# Altium schematic sheet Elkapod_power_supply.SchDoc: Elkapod Power Supply Block Diagram
size A3; SheetNumber: 1; SheetTotal: 10
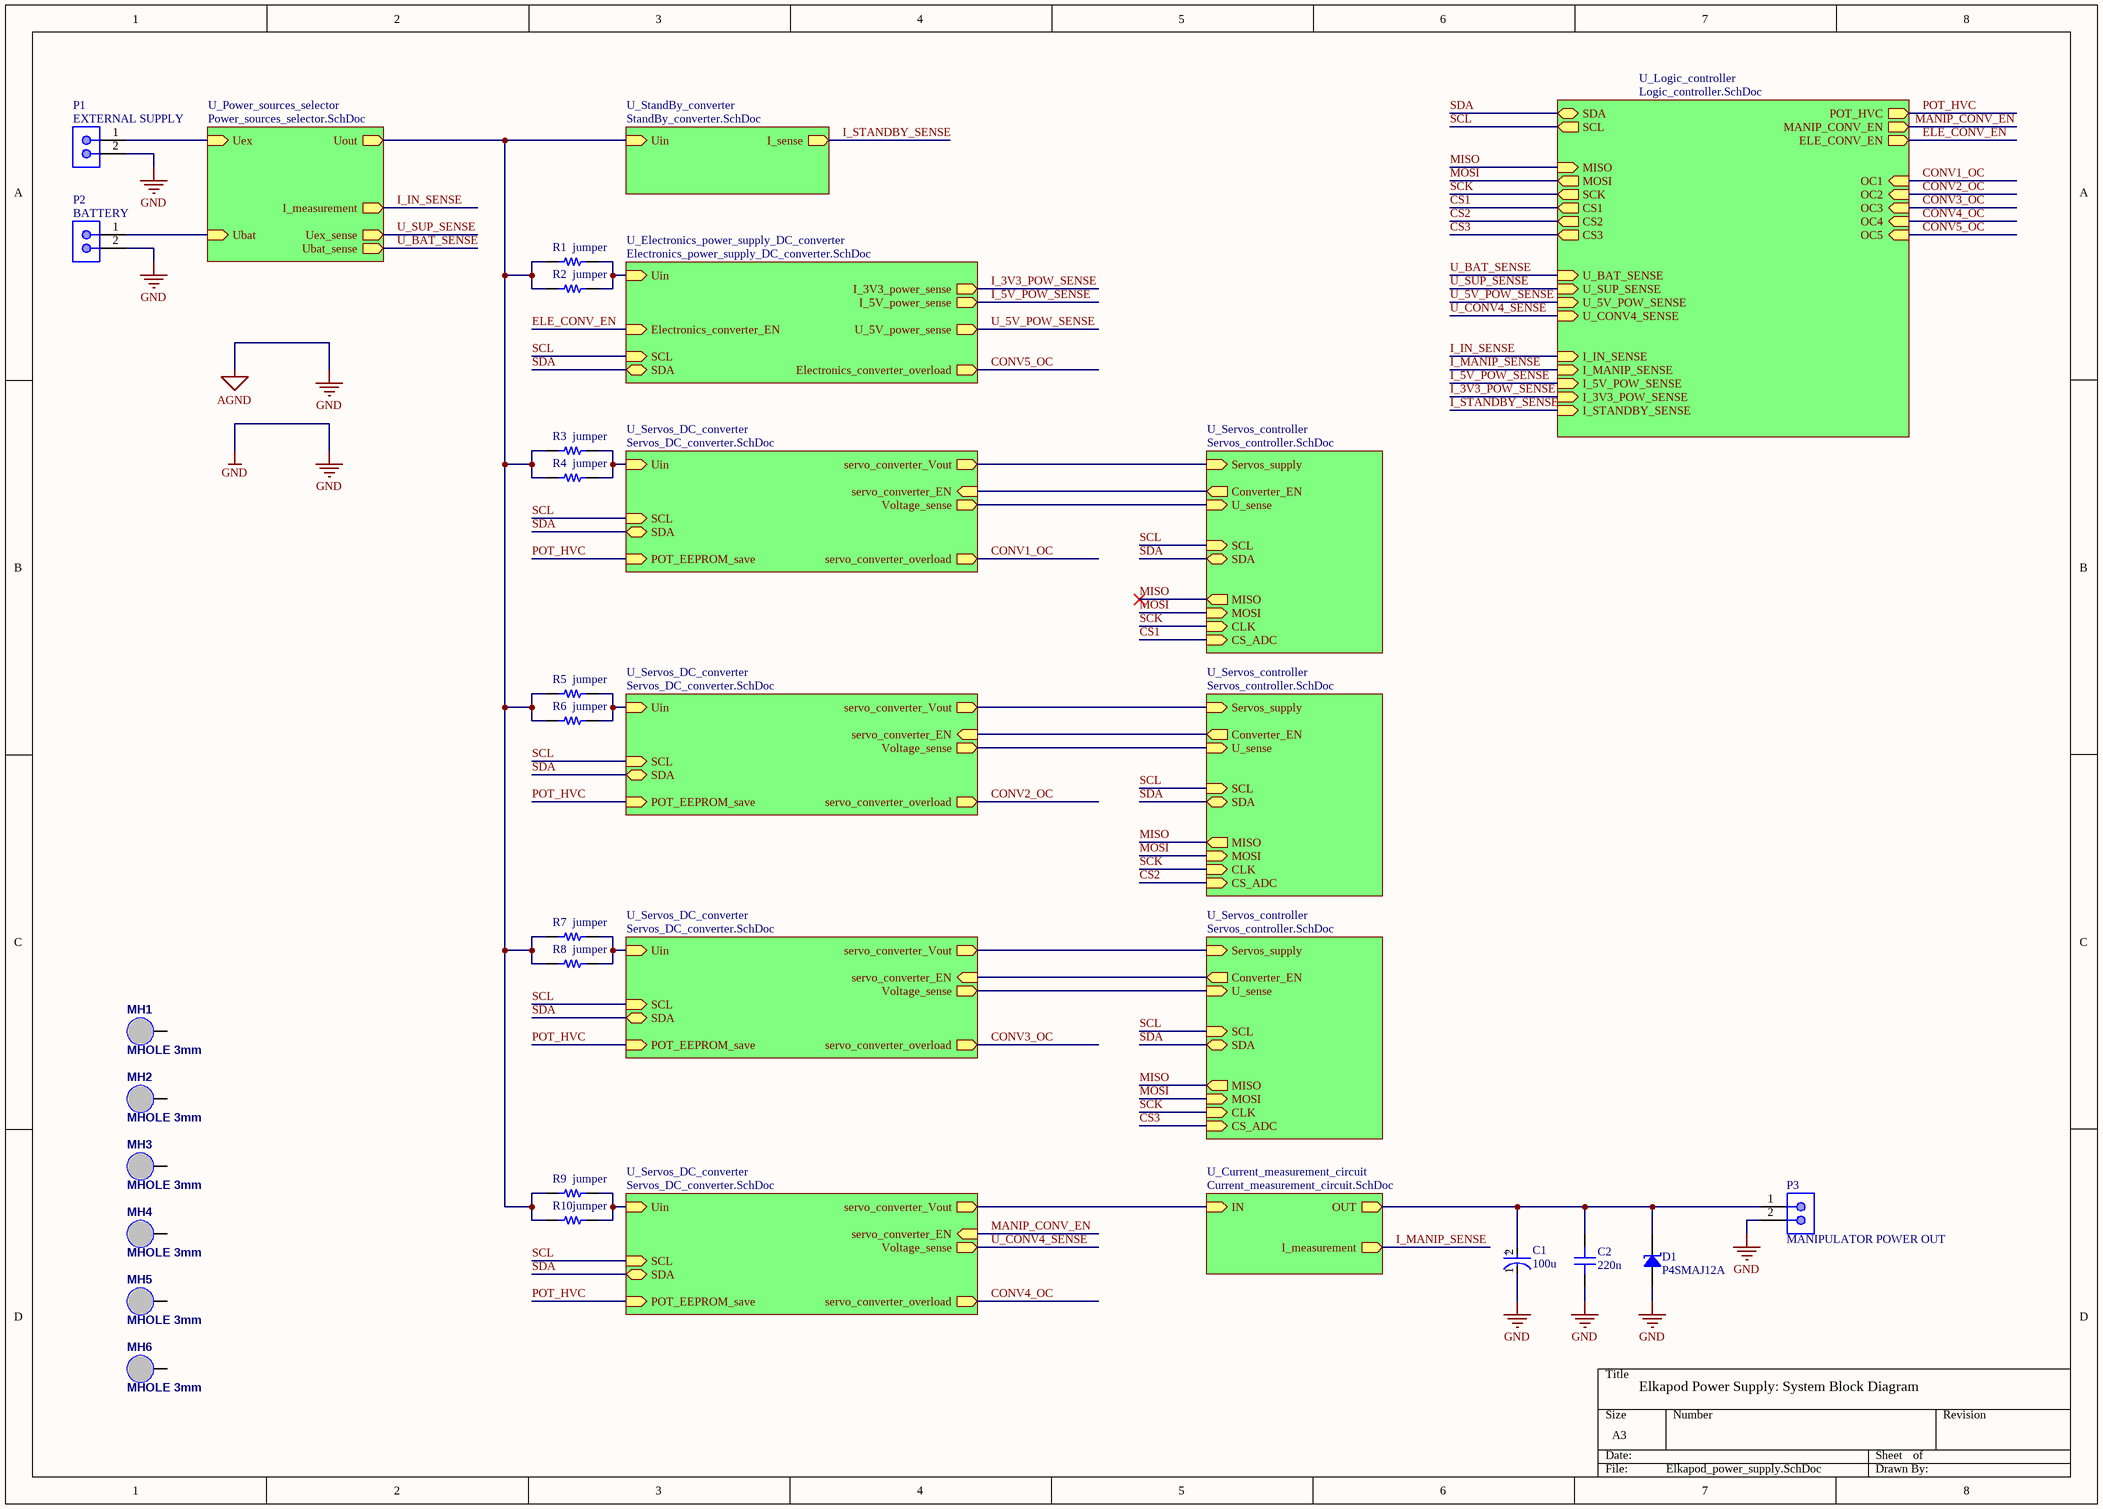
[diagram p0: Elkapod_power_supply.SchDoc]

## Parts
C1  100u  [FP-FKE-MFG]
C2  220n  [CAP 0603_1608]
D1  P4SMAJ12A  [DO214AC SMA]
MH1  MHOLE 3mm  [3mm screw drill III]  (no BOM)
MH2  MHOLE 3mm  [3mm screw drill III]  (no BOM)
MH3  MHOLE 3mm  [3mm screw drill III]  (no BOM)
MH4  MHOLE 3mm  [3mm screw drill III]  (no BOM)
MH5  MHOLE 3mm  [3mm screw drill III]  (no BOM)
MH6  MHOLE 3mm  [3mm screw drill III]  (no BOM)
P1  EXTERNAL SUPPLY  [XT60PW-M]
P2  BATTERY  [XT60PW-M]
P3  MANIPULATOR POWER OUT  [XT60PW-M]
R1  jumper  [STACKPOLE CSM2512]
R2  jumper  [STACKPOLE CSM2512]
R3  jumper  [STACKPOLE CSM2512]
R4  jumper  [STACKPOLE CSM2512]
R5  jumper  [STACKPOLE CSM2512]
R6  jumper  [STACKPOLE CSM2512]
R7  jumper  [STACKPOLE CSM2512]
R8  jumper  [STACKPOLE CSM2512]
R9  jumper  [STACKPOLE CSM2512]
R10  jumper  [STACKPOLE CSM2512]

## Sub-sheets
U_Current_measurement_circuit = Current_measurement_circuit.SchDoc: I_measurement (out), IN (in), OUT (out)  | Rsense_value: 1m
U_Electronics_power_supply_DC_converter = Electronics_power_supply_DC_converter.SchDoc: Uin (in), Electronics_converter_EN (in), Electronics_converter_overload (out), I_3V3_power_sense (out), I_5V_power_sense (out), U_5V_power_sense (out), SCL (in), SDA (bidir)
U_Logic_controller = Logic_controller.SchDoc: POT_HVC (out), MANIP_CONV_EN (out), ELE_CONV_EN (out), MOSI (out), MISO (in), SCK (out), SDA (bidir), SCL (out), I_IN_SENSE (in), I_5V_POW_SENSE (in), I_3V3_POW_SENSE (in), I_MANIP_SENSE (in), I_STANDBY_SENSE (in), U_BAT_SENSE (in), U_SUP_SENSE (in), U_CONV4_SENSE (in), U_5V_POW_SENSE (in), CS3 (out), CS2 (out), CS1 (out), OC1 (in), OC2 (in), OC3 (in), OC4 (in), OC5 (in)
U_Power_sources_selector = Power_sources_selector.SchDoc: Ubat (in), Uout (out), I_measurement (out), Uex (in), Uex_sense (out), Ubat_sense (out)
U_Servos_controller = Servos_controller.SchDoc: CS_ADC (in), Servos_supply (in), Converter_EN (out), U_sense (in), SCL (in), SDA (bidir), MOSI (in), CLK (in), MISO (out)
U_Servos_controller = Servos_controller.SchDoc: CS_ADC (in), Servos_supply (in), Converter_EN (out), U_sense (in), SCL (in), SDA (bidir), MOSI (in), CLK (in), MISO (out)
U_Servos_controller = Servos_controller.SchDoc: CS_ADC (in), Servos_supply (in), Converter_EN (out), U_sense (in), SCL (in), SDA (bidir), MOSI (in), CLK (in), MISO (out)
U_Servos_DC_converter = Servos_DC_converter.SchDoc: Uin (in), servo_converter_EN (in), servo_converter_overload (out), servo_converter_Vout (out), POT_EEPROM_save (in), Voltage_sense (out), SDA (bidir), SCL (in)  | RF2_value: 2,7k; RF1_value: 1k; RF3_value: 910
U_Servos_DC_converter = Servos_DC_converter.SchDoc: Uin (in), servo_converter_EN (in), servo_converter_overload (out), servo_converter_Vout (out), POT_EEPROM_save (in), Voltage_sense (out), SDA (bidir), SCL (in)  | RF2_value: 2,7k; RF1_value: 1k; RF3_value: 910
U_Servos_DC_converter = Servos_DC_converter.SchDoc: Uin (in), servo_converter_EN (in), servo_converter_overload (out), servo_converter_Vout (out), POT_EEPROM_save (in), Voltage_sense (out), SDA (bidir), SCL (in)  | RF2_value: 2,7k; RF1_value: 1k; RF3_value: 910
U_Servos_DC_converter = Servos_DC_converter.SchDoc: Uin (in), servo_converter_EN (in), servo_converter_overload (out), servo_converter_Vout (out), POT_EEPROM_save (in), Voltage_sense (out), SDA (bidir), SCL (in)  | RF2_value: 6,8k; RF1_value: 3,3k; RF3_value: 1,3k
U_StandBy_converter = StandBy_converter.SchDoc: Uin (in), I_sense (out)

## Nets
AGND: C1.1(C) C2.2 D1.1 P1.2(-) P2.2(-) P3.2(-)  [also labelled GND]
CONV1_OC: sheet U_Servos_DC_converter/servo_converter_overload, sheet U_Logic_controller/OC1
CONV2_OC: sheet U_Servos_DC_converter/servo_converter_overload, sheet U_Logic_controller/OC2
CONV3_OC: sheet U_Servos_DC_converter/servo_converter_overload, sheet U_Logic_controller/OC3
CONV4_OC: sheet U_Servos_DC_converter/servo_converter_overload, sheet U_Logic_controller/OC4
CONV5_OC: sheet U_Electronics_power_supply_DC_converter/Electronics_converter_overload, sheet U_Logic_controller/OC5
CS1: sheet U_Servos_controller/CS_ADC, sheet U_Logic_controller/CS1
CS2: sheet U_Servos_controller/CS_ADC, sheet U_Logic_controller/CS2
CS3: sheet U_Servos_controller/CS_ADC, sheet U_Logic_controller/CS3
ELE_CONV_EN: sheet U_Electronics_power_supply_DC_converter/Electronics_converter_EN, sheet U_Logic_controller/ELE_CONV_EN
I_3V3_POW_SENSE: sheet U_Electronics_power_supply_DC_converter/I_3V3_power_sense, sheet U_Logic_controller/I_3V3_POW_SENSE
I_5V_POW_SENSE: sheet U_Electronics_power_supply_DC_converter/I_5V_power_sense, sheet U_Logic_controller/I_5V_POW_SENSE
I_IN_SENSE: sheet U_Power_sources_selector/I_measurement, sheet U_Logic_controller/I_IN_SENSE
I_MANIP_SENSE: sheet U_Current_measurement_circuit/I_measurement, sheet U_Logic_controller/I_MANIP_SENSE
I_STANDBY_SENSE: sheet U_StandBy_converter/I_sense, sheet U_Logic_controller/I_STANDBY_SENSE
MANIP_CONV_EN: sheet U_Servos_DC_converter/servo_converter_EN, sheet U_Logic_controller/MANIP_CONV_EN
MISO: sheet U_Servos_controller/MISO, sheet U_Servos_controller/MISO, sheet U_Servos_controller/MISO, sheet U_Logic_controller/MISO
MOSI: sheet U_Servos_controller/MOSI, sheet U_Servos_controller/MOSI, sheet U_Servos_controller/MOSI, sheet U_Logic_controller/MOSI
POT_HVC: sheet U_Servos_DC_converter/POT_EEPROM_save, sheet U_Servos_DC_converter/POT_EEPROM_save, sheet U_Servos_DC_converter/POT_EEPROM_save, sheet U_Servos_DC_converter/POT_EEPROM_save, sheet U_Logic_controller/POT_HVC
SCK: sheet U_Servos_controller/CLK, sheet U_Servos_controller/CLK, sheet U_Servos_controller/CLK, sheet U_Logic_controller/SCK
SCL: sheet U_Servos_controller/SCL, sheet U_Servos_DC_converter/SCL, sheet U_Electronics_power_supply_DC_converter/SCL, sheet U_Servos_controller/SCL, sheet U_Servos_controller/SCL, sheet U_Servos_DC_converter/SCL, sheet U_Servos_DC_converter/SCL, sheet U_Servos_DC_converter/SCL, sheet U_Logic_controller/SCL
SDA: sheet U_Servos_controller/SDA, sheet U_Servos_DC_converter/SDA, sheet U_Electronics_power_supply_DC_converter/SDA, sheet U_Servos_controller/SDA, sheet U_Servos_controller/SDA, sheet U_Servos_DC_converter/SDA, sheet U_Servos_DC_converter/SDA, sheet U_Servos_DC_converter/SDA, sheet U_Logic_controller/SDA
U_5V_POW_SENSE: sheet U_Electronics_power_supply_DC_converter/U_5V_power_sense, sheet U_Logic_controller/U_5V_POW_SENSE
U_BAT_SENSE: sheet U_Power_sources_selector/Ubat_sense, sheet U_Logic_controller/U_BAT_SENSE
U_CONV4_SENSE: sheet U_Servos_DC_converter/Voltage_sense, sheet U_Logic_controller/U_CONV4_SENSE
U_SUP_SENSE: sheet U_Power_sources_selector/Uex_sense, sheet U_Logic_controller/U_SUP_SENSE
NetC1_2: C1.2(A) C2.1 D1.2 P3.1(+) ; sheet U_Current_measurement_circuit/OUT
NetP1_1: P1.1(+) ; sheet U_Power_sources_selector/Uex
NetP2_1: P2.1(+) ; sheet U_Power_sources_selector/Ubat
NetR1_1: R1.1 R2.1 ; sheet U_Electronics_power_supply_DC_converter/Uin
NetR1_2: R1.2 R2.2 R3.2 R4.2 R5.2 R6.2 R7.2 R8.2 R9.2 R10.2 ; sheet U_Power_sources_selector/Uout, sheet U_StandBy_converter/Uin
NetR3_1: R3.1 R4.1 ; sheet U_Servos_DC_converter/Uin
NetR5_1: R5.1 R6.1 ; sheet U_Servos_DC_converter/Uin
NetR7_1: R7.1 R8.1 ; sheet U_Servos_DC_converter/Uin
NetR9_1: R9.1 R10.1 ; sheet U_Servos_DC_converter/Uin
(unnamed): sheet U_Servos_controller/Servos_supply, sheet U_Servos_DC_converter/servo_converter_Vout
(unnamed): sheet U_Servos_controller/Converter_EN, sheet U_Servos_DC_converter/servo_converter_EN
(unnamed): sheet U_Servos_controller/U_sense, sheet U_Servos_DC_converter/Voltage_sense
(unnamed): sheet U_Current_measurement_circuit/IN, sheet U_Servos_DC_converter/servo_converter_Vout
(unnamed): sheet U_Servos_controller/Servos_supply, sheet U_Servos_DC_converter/servo_converter_Vout
(unnamed): sheet U_Servos_controller/Converter_EN, sheet U_Servos_DC_converter/servo_converter_EN
(unnamed): sheet U_Servos_controller/U_sense, sheet U_Servos_DC_converter/Voltage_sense
(unnamed): sheet U_Servos_controller/Servos_supply, sheet U_Servos_DC_converter/servo_converter_Vout
(unnamed): sheet U_Servos_controller/Converter_EN, sheet U_Servos_DC_converter/servo_converter_EN
(unnamed): sheet U_Servos_controller/U_sense, sheet U_Servos_DC_converter/Voltage_sense

Not connected (* = marked no-connect by the designer): MH1 1(GND); MH2 1(GND); MH3 1(GND); MH4 1(GND); MH5 1(GND); MH6 1(GND)

## Notes on the sheet
- Elkapod Power Supply: System Block Diagram
- (in symbol CMP-2000-06205-2) +

## Library data of the parts
C1 = CMP-2000-06205-2: CAP ALUM 100UF 20% 25V SMD; Ripple Current (AC): 300mA; Leakage Current: 3uA; Dielectric Material: Aluminium; Impedance: 260mR; Life (Hours): 2000Hour; Max Operating Temperature: 105°C; Voltage Rating (DC): 25V; Packaging: Tape and Reel; Min Operating Temperature: -55°C; Capacitance: 100uF; Ripple Current: 300mA; Mount: Surface Mount; Lead Free: Lead Free; Construction: Cylindrical; Voltage Rating: 25V; RoHS Compliant: Yes; Case/Package: Radial; Height: 6.2mm; Tolerance: 20%; Diameter: 8mm; Termination: SMD/SMT; Package Quantity: 1; Width: 8.3mm; REACH SVHC: No SVHC; Series: FK; Number of Pins: 2; Voltage: 25V; Radiation Hardening: No; Height - Seated (Max): 0.244inch; Length: 6.2mm; ESR (Equivalent Series Resistance): 260mR
C2 = C0603C272F3GAC7867: CAP CER 220nF 25V X5R 0603; manufacturer: KEMET; Temperature Coefficient: C0G, NP0; Tolerance: ±1%; Part Number: C0603C272F3GAC7867; Value: 220n; Applications: General Purpose; Capacitance: 220n; componentlink1description: Datasheet; componentlink1url: https://api.kemet.com/component-edge/download/datasheet/C0603C272F3GACTU.pdf; componentlink2description: DigiKey Link; componentlink2url: https://www.digikey.com/en/products/detail/kemet/C0603C272F3GAC7867/2200413; Device Package: 0603 (1608 Metric); Features: Low ESL; lastupdated: 09.02.2024 20:10:30; Lifecycle Status: Active; Minimum Order: 1; Mounting Type: Surface Mount, MLCC; Operating Temperature: -55°C ~ 125°C; Package / Case: 0603 (1608 Metric); packaging: TapeAndReel; partid: 2138; Part Status: Active; price: 0.40; series: SMD Comm C0G; Size / Dimension: 0.063" L x 0.031" W (1.60mm x 0.80mm); Thickness (Max): 0.034" (0.87mm); Voltage - Rated: 25V
D1 = SMA6J18A-TP: TVS DIODE 12VDC DO214AC; Part Number: P4SMAJ9.0A
MH1-MH6 = MHOLE_3MM: 3mm Mounting Hole
P1-P3 = XT60PW-M: XT60PW-M; 30A/500V angled female DC PCB socket (pin1 -> +, pin2 -> -)
R1-R10 = CSM2512FT20L0: RES 0 OHM 1W 2512; manufacturer: Stackpole Electronics Inc; Power (Watts): 3W; Temperature Coefficient: ±50ppm/°C; Tolerance: ±1%; value: 20 mOhms; Part Number: CSM2512FT20L0; componentlink1description: Datasheet; componentlink1url: https://www.seielect.com/Catalog/SEI-CSM.PDF; componentlink2description: DigiKey Link; componentlink2url: https://www.digikey.com/en/products/detail/stackpole-electronics-inc/CSM2512FT20L0/6270239; Composition: Metal Element; Device Package: 2512 (6332 Metric); Features: Current Sense; Height - Seated (Max): 0.035" (0.90mm); lastupdated: 03.06.2024 20:27:03; Lifecycle Status: Active; Minimum Order: 4000; Number of Terminations: 2; Operating Temperature: -55°C ~ 170°C; Package / Case: 2512 (6332 Metric); packaging: TapeAndReel; Part Status: Active; price: 0.19; Resistance: jumper; series: CSM; Size / Dimension: 0.252" L x 0.126" W (6.40mm x 3.20mm); Supplier Device Package: 2512